# EAGLE schematic l5 (EAGLE 5.10)
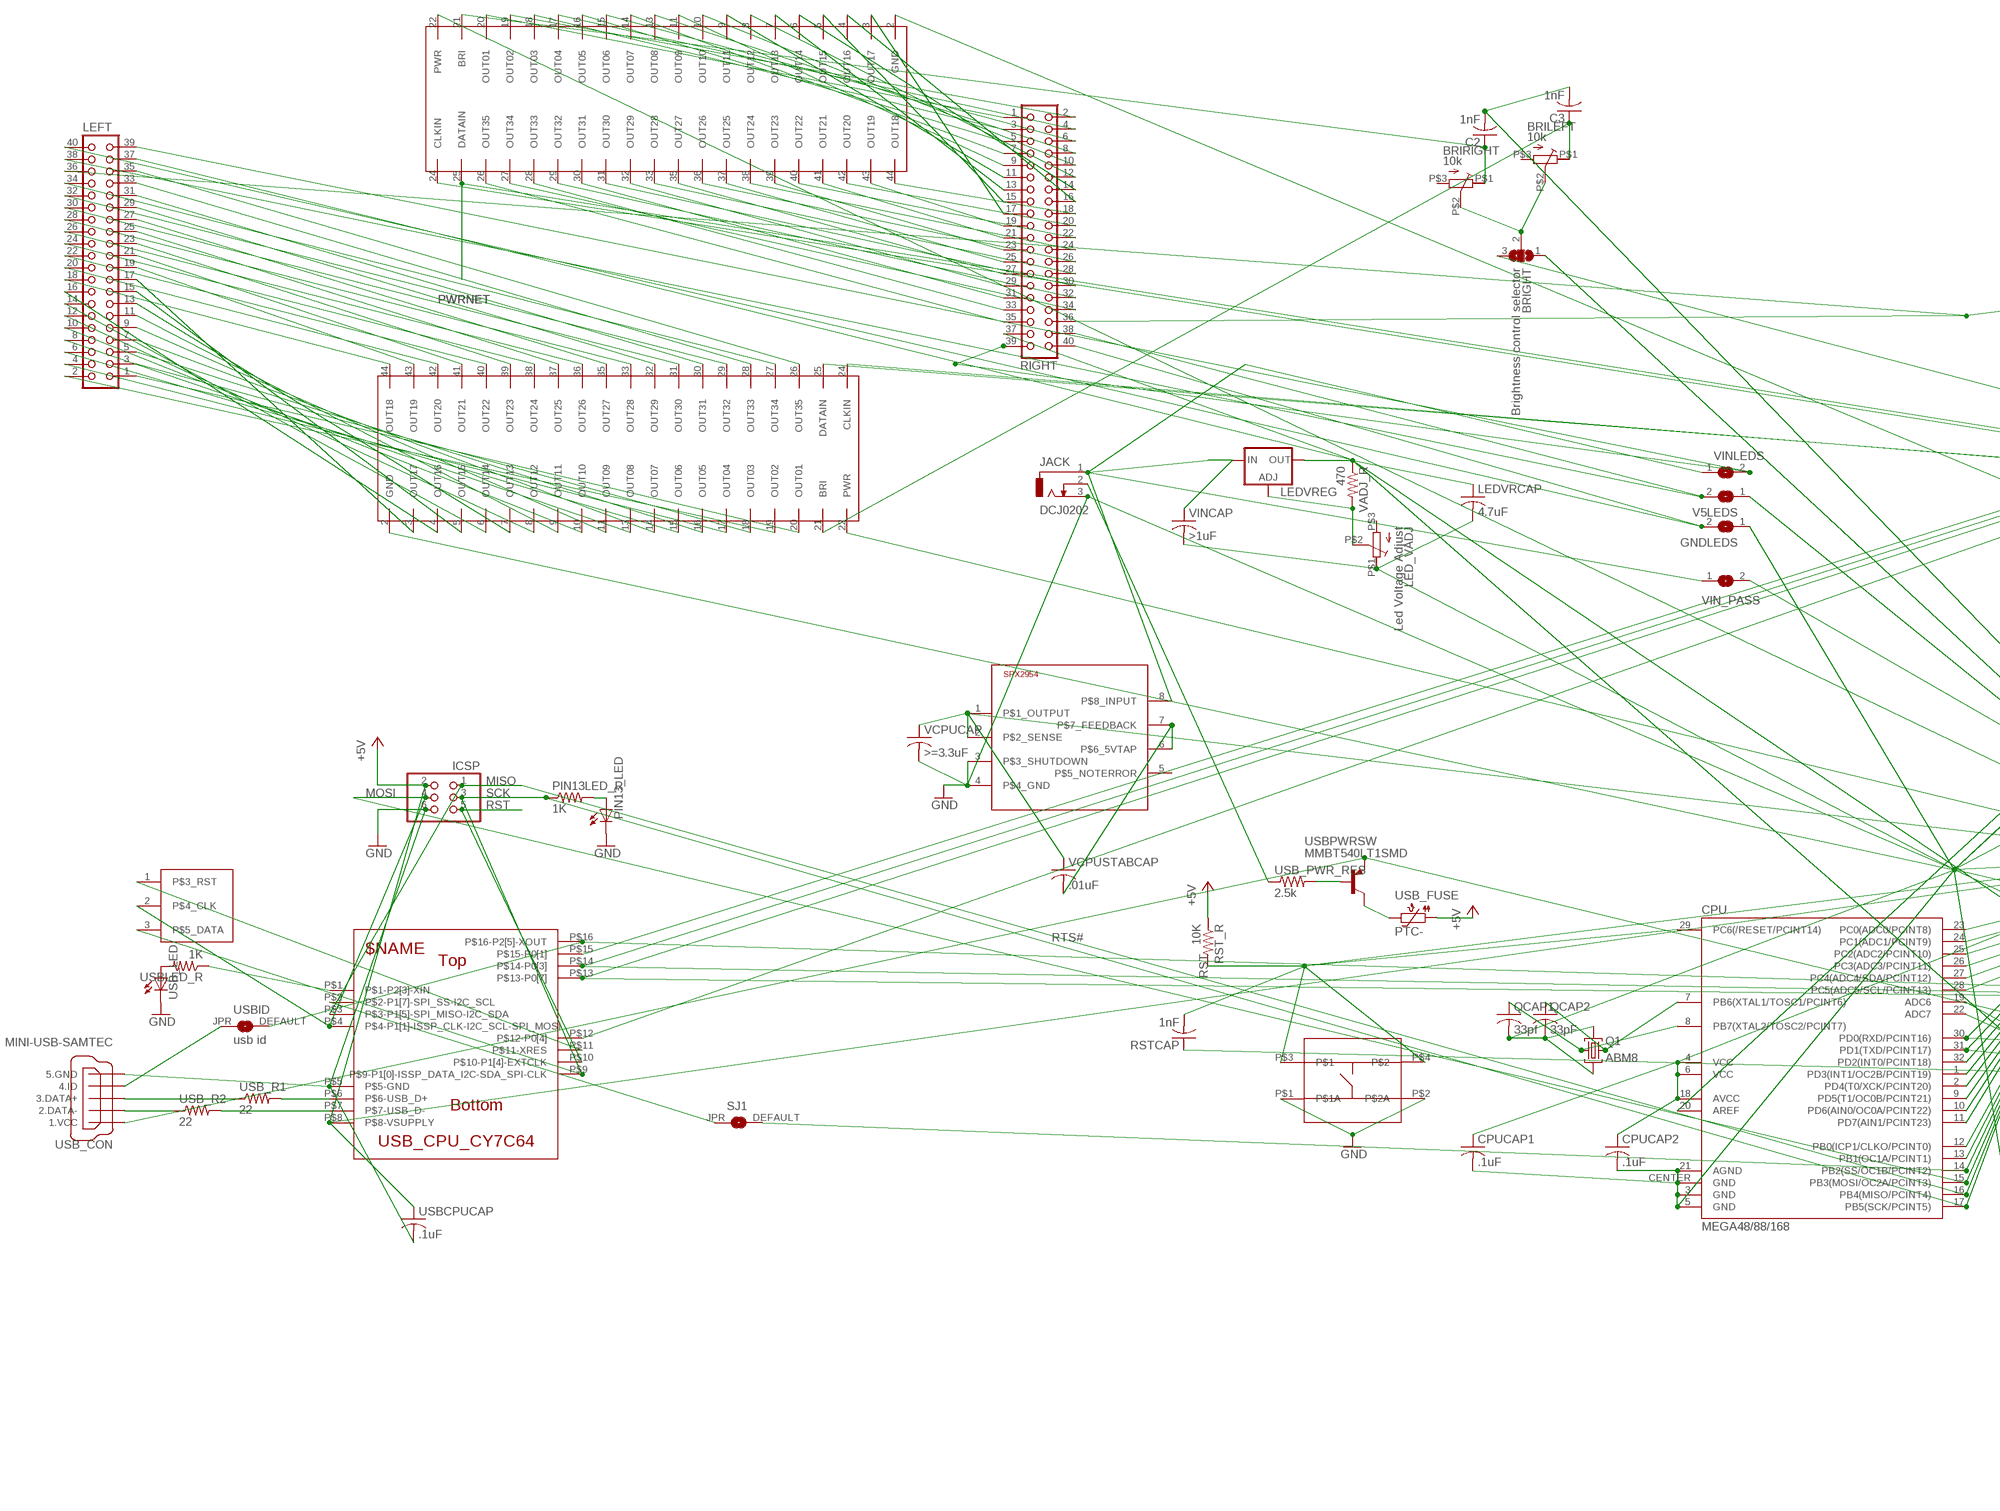
[diagram p0: schematic, sheet 1, part 1 of 2]
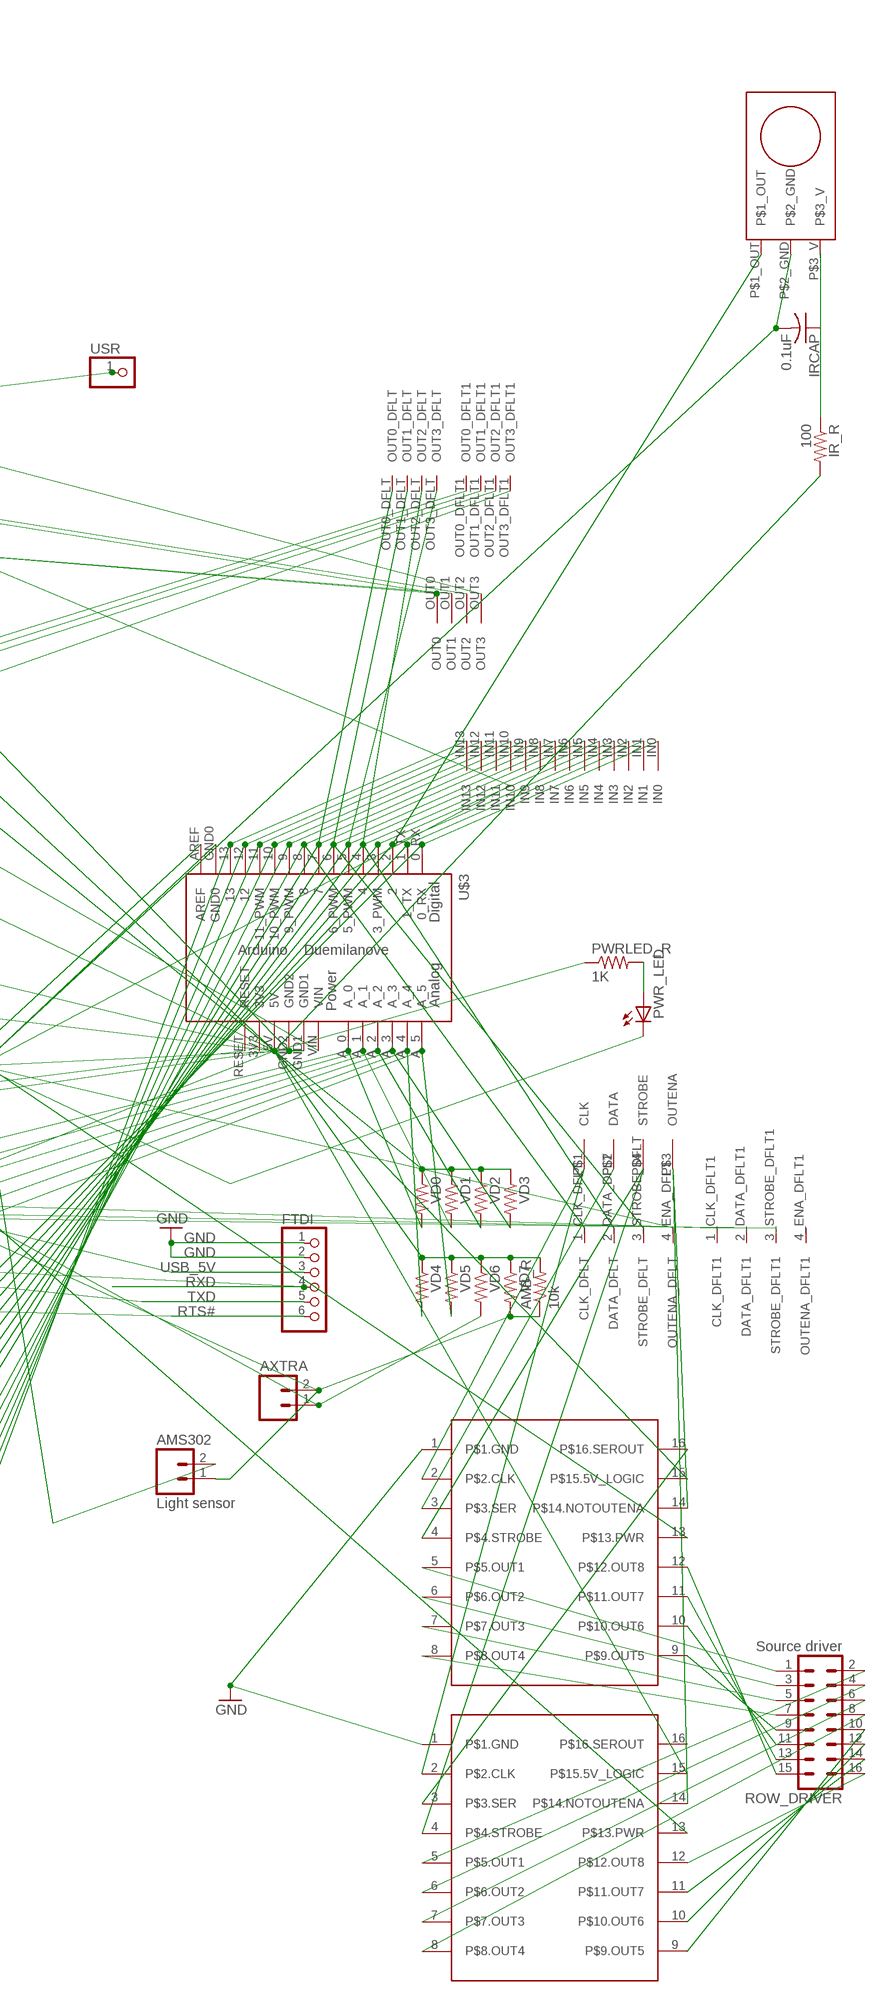
[diagram p1: schematic, sheet 1, part 2 of 2]

## Parts
5VREG  SPX2954  [SO08]
AMB_R  10k  R-US_R0603  [R0603]
AMS302  Light sensor  M02PTH  [1X02]
AXTRA  M02PTH  [1X02]
BRIGHT  Brightness control selector  SJ2W  [SJ_2]
BRILEFT  10k  PVZ2_TRIM_POT  [PVZ2A_TRIM_POT]
BRIRIGHT  10k  PVZ2_TRIM_POT  [PVZ2A_TRIM_POT]
C2  1nF  RCL_C-USC0603  [RCL_C0603]
C3  1nF  RCL_C-USC0603  [RCL_C0603]
CPU  MEGA48/88/168  [MLF32]
CPUCAP1  .1uF  C-USC0603  [C0603]
CPUCAP2  .1uF  C-USC0603  [C0603]
CY7C64316  USB_CPU_CY7C64315  [QFN16-3X3]
CY_PRG_MINI  CY_PRG_MIN  [HEADER_3X1]
DRVR_BOT  MIC5891  [SO16W]
DRVR_TOP  MIC5891  [SO16W]
FTDI  PINHD-1X6CLEAN  [1X06-CLEAN]
GNDLEDS  SJ  [SJ]
ICSP  PINHD-2X3  [2X03]
IR_R  100  R-US_R0603  [R0603]
IR_RECV  TSOP34138_IR_RECIEVER  [TSOP34138]
IRCAP  0.1uF  RCL_C-USC0603  [RCL_C0603]
JACK  DCJ0202  [DCJ0202]
LED_VADJ  Led Voltage Adjust  PVZ2_TRIM_POT  [PVZ2A_TRIM_POT]
LEDVRCAP  4.7uF  RCL_C-USC0805  [RCL_C0805]
LEDVREG  LM317BD2T  [D2PACK]
LEFT  CON-HARTING_CON40L  [CON-HARTING_CON40L]
M5451_LEFT  STONE_ST-M5451  [PLCC44]
M5451_RIGHT  STONE_ST-M5451  [PLCC44]
PIN13_LED  LEDCHIPLED_1206  [CHIPLED_1206]
PIN13LED_R  1K  R-US_R0603  [R0603]
PWR_LED  LEDCHIPLED_1206  [CHIPLED_1206]
PWRLED_R  1K  R-US_R0603  [R0603]
Q1  ABM8  [CRYSTAL_ABM8]
QCAP1  33pf  C-USC0603  [C0603]
QCAP2  33pF  C-USC0603  [C0603]
RESET_SWITCH  RA_SWITCH  [RA_SWITCH]
RIGHT  CON-HARTING_CON40L  [CON-HARTING_CON40L]
ROW_DRIVER  Source driver  MA08-2  [MA08-2]
RST_R  10K  R-US_R0603  [R0603]
RSTCAP  1nF  RCL_C-USC0603  [RCL_C0603]
SJ1  SJWIRE_HOLE_WITH_DEFAULT  [JUMPER_HOLE_WITH_SMT_DEFAULT_PAD]
U$3  ARDUINO-USBOCTAGONAL_PADS  [SHIELD-OCTAGONALPAD]
U$5  LEDSRCSEL  [LEDSRCSEL]
U$6  DUINO_DIGITAL_SOLDER_PTS  [DUINO_DIGITAL_SOLDER_PTS]
U$7  QUAD_SOLDER_PTS_WITH_2_DEFAULTS  [QUAD_SOLDER_PTS_WITH_2_DEFAULTS]
USB_CON  MINI-USB-SAMTEC  [SAMTEC_MUSB_05]
USB_FUSE  PTC-  [RCL_C0603]
USB_LED  LEDCHIPLED_1206  [CHIPLED_1206]
USB_PWR_RES  2.5k  R-US_R0603  [R0603]
USB_R1  22  R-US_R0603  [R0603]
USB_R2  22  R-US_R0603  [R0603]
USBCPUCAP  .1uF  C-USC0603  [C0603]
USBID  usb id  SJWIRE_HOLE_WITH_DEFAULT  [JUMPER_HOLE_WITH_SMT_DEFAULT_PAD]
USBLED_R  1K  R-US_R0603  [R0603]
USBPWRSW  MMBT540LT1SMD  [SOT23-BEC]
USR  PINHD-1X1  [1X01]
V5LEDS  SJ  [SJ]
VADJ_R  470  RCL_R-US_R0603  [RCL_R0603]
VCPUCAP  >=3.3uF  RCL_C-USC0603  [RCL_C0603]
VCPUSTABCAP  .01uF  C-USC0603  [C0603]
VD0  R-US_0204/5  [0204/5]
VD1  R-US_0204/5  [0204/5]
VD2  R-US_0204/5  [0204/5]
VD3  R-US_0204/5  [0204/5]
VD4  R-US_0204/5  [0204/5]
VD5  R-US_0204/5  [0204/5]
VD6  R-US_0204/5  [0204/5]
VD7  R-US_0204/5  [0204/5]
VIN_PASS  SJ  [SJ]
VINCAP  >1uF  C-USC0603  [C0603]
VINLEDS  SJ  [SJ]

## Nets
+5V [PWR]: 5VREG.1(P$1_OUTPUT) 5VREG.2(P$2_SENSE) AMB_R.2 BRIGHT.1 CPU.4(VCC) CPU.6(VCC) CPU.18(AVCC) CPUCAP1.1 CPUCAP2.1 CY7C64316.P$8(P$8-VSUPPLY) DRVR_BOT.15(P$15.5V_LOGIC) DRVR_TOP.15(P$15.5V_LOGIC) ICSP.2 IR_R.2 M5451_LEFT.22(PWR) M5451_RIGHT.22(PWR) PWRLED_R.1 RST_R.1 U$3.5V USB_FUSE.1 USBCPUCAP.1 V5LEDS.1 VCPUCAP.1 VCPUSTABCAP.1 VD0.1 VD1.1 VD2.1 VD3.1 VD4.1 VD5.1 VD6.1 VD7.1
BRIGHT_NET: BRIGHT.3 U$7.OUT3
BRISEL0 [CHIPCOM]: BRIRIGHT.P$1(A) C2.1 M5451_RIGHT.21(BRI)
BRISEL1 [CHIPCOM]: BRILEFT.P$1(A) C3.1 M5451_LEFT.21(BRI)
CLK [CHIPCOM]: M5451_LEFT.24(CLKIN) M5451_RIGHT.24(CLKIN) U$7.OUT0
CLK1: CPU.7(PB6(XTAL1/TOSC1/PCINT6)) Q1.P$3 QCAP2.1
CLK2: CPU.8(PB7(XTAL2/TOSC2/PCINT7)) Q1.P$1 QCAP1.1
CPUVOLTAGESEL2IDE [PWR]: LEFT.38 RIGHT.38 V5LEDS.2
DATA0 [CHIPCOM]: CPU.11(PD7(AIN1/PCINT23)) U$3.7 U$6.IN7 U$7.OUT0_DFLT
DATA1 [CHIPCOM]: CPU.9(PD5(T1/OC0B/PCINT21)) U$3.5(5_PWM) U$6.IN5 U$7.OUT3_DFLT
GND [GND]: 5VREG.3(P$3_SHUTDOWN) 5VREG.4(P$4_GND) AMS302.2 C2.2 C3.2 CPU.3(GND) CPU.5(GND) CPU.21(AGND) CPU.CENTER(GND) CPUCAP1.2 CPUCAP2.2 CY7C64316.P$5(P$5-GND) DRVR_BOT.1(P$1.GND) DRVR_TOP.1(P$1.GND) FTDI.1 FTDI.2 GNDLEDS.1 ICSP.6 IR_RECV.P$2_GND IRCAP.2 JACK.3 LED_VADJ.P$1(A) LEDVRCAP.2 M5451_LEFT.2(GND) M5451_RIGHT.2(GND) PIN13_LED.C PWR_LED.C Q1.P$GND1(GND1) Q1.P$GND2(GND2) QCAP1.2 QCAP2.2 RESET_SWITCH.P$1(P$1A) RESET_SWITCH.P$2(P$2A) U$3.GND0 U$3.GND1 U$3.GND2 U$5.4_ENA_DFLT(OUTENA_DFLT) USB_CON.5(5.GND) USB_LED.C USBCPUCAP.2 VCPUCAP.2 VINCAP.2
GND3 [GND]: GNDLEDS.2 LEFT.40 RIGHT.40
LEDPWR [LEDPWR]: DRVR_BOT.13(P$13.PWR) DRVR_TOP.13(P$13.PWR) LEDVRCAP.1 LEDVREG.2(OUT) LEFT.37 RIGHT.37 VADJ_R.1
LEFTDATA [CHIPCOM]: M5451_LEFT.25(DATAIN) U$7.OUT1
MISO: CPU.16(PB4(MISO/PCINT4)) CY7C64316.P$3(P$3-P1[5]-SPI_MISO-I2C_SDA) ICSP.1 U$3.12 U$6.IN12
MOSI [CHIPCOM]: CPU.15(PB3(MOSI/OC2A/PCINT3)) CY7C64316.P$4(P$4-P1[1]-ISSP_CLK-I2C_SCL-SPI_MOSI) CY_PRG_MINI.2(P$4_CLK) ICSP.4 U$3.11(11_PWM) U$6.IN11
N$1: PIN13_LED.A PIN13LED_R.2
N$2: BRIGHT.2 BRILEFT.P$2(S) BRIRIGHT.P$2(S)
N$3: AXTRA.1 CPU.19(ADC6) VD6.2
N$4 [PWR]: U$3.VIN VIN_PASS.2
N$5: AMB_R.1 AMS302.1 AXTRA.2 CPU.22(ADC7) VD7.2
N$6: M5451_RIGHT.20(OUT01) RIGHT.1
N$7: M5451_RIGHT.19(OUT02) RIGHT.2
N$8: M5451_RIGHT.18(OUT03) RIGHT.3
N$9: M5451_RIGHT.17(OUT04) RIGHT.4
N$10: M5451_RIGHT.16(OUT05) RIGHT.5
N$11: M5451_RIGHT.15(OUT06) RIGHT.6
N$12: M5451_RIGHT.14(OUT07) RIGHT.7
N$13: M5451_RIGHT.13(OUT08) RIGHT.8
N$14: M5451_RIGHT.11(OUT09) RIGHT.9
N$15: M5451_RIGHT.10(OUT10) RIGHT.10
N$16 [LEDROW]: DRVR_BOT.5(P$5.OUT1) ROW_DRIVER.1
N$17: M5451_RIGHT.9(OUT11) RIGHT.11
N$18: M5451_RIGHT.8(OUT12) RIGHT.12
N$19: M5451_RIGHT.7(OUT13) RIGHT.13
N$20: M5451_RIGHT.6(OUT14) RIGHT.14
N$21: M5451_RIGHT.5(OUT15) RIGHT.15
N$22: M5451_RIGHT.4(OUT16) RIGHT.16
N$23: M5451_RIGHT.3(OUT17) RIGHT.17
N$24: M5451_RIGHT.44(OUT18) RIGHT.18
N$25: M5451_RIGHT.43(OUT19) RIGHT.19
N$26: M5451_RIGHT.42(OUT20) RIGHT.20
N$27: M5451_RIGHT.41(OUT21) RIGHT.21
N$28: M5451_RIGHT.40(OUT22) RIGHT.22
N$29: M5451_RIGHT.39(OUT23) RIGHT.23
N$30: M5451_RIGHT.38(OUT24) RIGHT.24
N$31: M5451_RIGHT.37(OUT25) RIGHT.25
N$32: M5451_RIGHT.36(OUT26) RIGHT.26
N$33: M5451_RIGHT.35(OUT27) RIGHT.27
N$34: M5451_RIGHT.33(OUT28) RIGHT.28
N$35: M5451_RIGHT.32(OUT29) RIGHT.29
N$36: M5451_RIGHT.31(OUT30) RIGHT.30
N$37: M5451_RIGHT.30(OUT31) RIGHT.31
N$38: M5451_RIGHT.29(OUT32) RIGHT.32
N$39: M5451_RIGHT.28(OUT33) RIGHT.33
N$40: M5451_RIGHT.27(OUT34) RIGHT.34
N$41: M5451_RIGHT.26(OUT35) RIGHT.35
N$42 [LEDROW]: DRVR_BOT.6(P$6.OUT2) ROW_DRIVER.3
N$43: CPU.32(PD2(INT0/PCINT18)) IR_RECV.P$1_OUT U$3.2 U$6.IN2
N$44 [LEDROW]: DRVR_BOT.7(P$7.OUT3) ROW_DRIVER.5
N$45: LEFT.1 M5451_LEFT.20(OUT01)
N$46: LEFT.2 M5451_LEFT.19(OUT02)
N$47: LEFT.3 M5451_LEFT.18(OUT03)
N$48: LEFT.4 M5451_LEFT.17(OUT04)
N$49: CPU.1(PD3(INT1/OC2B/PCINT19)) U$3.3(3_PWM) U$6.IN3
N$50: LEFT.5 M5451_LEFT.16(OUT05)
N$51: LEFT.6 M5451_LEFT.15(OUT06)
N$52: LEFT.7 M5451_LEFT.14(OUT07)
N$53: LEFT.8 M5451_LEFT.13(OUT08)
N$54: LEFT.9 M5451_LEFT.11(OUT09)
N$55: LEFT.10 M5451_LEFT.10(OUT10)
N$56: LEFT.11 M5451_LEFT.9(OUT11)
N$57: LEFT.12 M5451_LEFT.8(OUT12)
N$58: LEFT.13 M5451_LEFT.7(OUT13)
N$59: LEFT.14 M5451_LEFT.6(OUT14)
N$60: LEFT.15 M5451_LEFT.5(OUT15)
N$61: LEFT.16 M5451_LEFT.4(OUT16)
N$62: LEFT.17 M5451_LEFT.3(OUT17)
N$63: LEFT.18 M5451_LEFT.44(OUT18)
N$64: LEFT.19 M5451_LEFT.43(OUT19)
N$65: LEFT.20 M5451_LEFT.42(OUT20)
N$66: LEFT.21 M5451_LEFT.41(OUT21)
N$67: LEFT.22 M5451_LEFT.40(OUT22)
N$68: LEFT.23 M5451_LEFT.39(OUT23)
N$69: LEFT.24 M5451_LEFT.38(OUT24)
N$70: LEFT.25 M5451_LEFT.37(OUT25)
N$71: LEFT.26 M5451_LEFT.36(OUT26)
N$72: LEFT.27 M5451_LEFT.35(OUT27)
N$73: LEFT.28 M5451_LEFT.33(OUT28)
N$74: LEFT.29 M5451_LEFT.32(OUT29)
N$75: LEFT.30 M5451_LEFT.31(OUT30)
N$76: LEFT.31 M5451_LEFT.30(OUT31)
N$77: LEFT.32 M5451_LEFT.29(OUT32)
N$78: LEFT.33 M5451_LEFT.28(OUT33)
N$79: LEFT.34 M5451_LEFT.27(OUT34)
N$80: CPU.2(PD4(T0/XCK/PCINT20)) U$3.4 U$5.2_DATA_DFLT(DATA_DFLT) U$6.IN4 U$7.OUT2_DFLT
N$81 [CHIPCOM]: CPU.10(PD6(AIN0/OC0A/PCINT22)) U$3.6(6_PWM) U$5.3_STROBE_DFLT(STROBE_DFLT) U$6.IN6 U$7.OUT1_DFLT
N$82: CY7C64316.P$1(P$1-P2[3]-XIN) USBLED_R.1
N$83: USB_CON.4(4.ID) USBID.JPR
N$84 [CHIPCOM]: CPU.12(PB0(ICP1/CLKO/PCINT0)) U$3.8 U$5.1_CLK_DFLT(CLK_DFLT) U$6.IN8
N$85 [CHIPCOM]: CPU.13(PB1(OC1A/PCINT1)) U$3.9(9_PWM) U$6.IN9
N$86 [CHIPCOM]: CPU.14(PB2(SS/OC1B/PCINT2)) SJ1.DEFAULT U$3.10(10_PWM) U$6.IN10
N$87 [LEDROW]: DRVR_BOT.8(P$8.OUT4) ROW_DRIVER.7
N$88 [LEDROW]: DRVR_BOT.9(P$9.OUT5) ROW_DRIVER.9
N$89 [LEDROW]: DRVR_BOT.10(P$10.OUT6) ROW_DRIVER.11
N$90: CY7C64316.P$15(P$15-P0[1]) U$7.OUT0_DFLT1
N$91: PWR_LED.A PWRLED_R.2
N$92: LED_VADJ.P$2(S) LEDVREG.1(ADJ) VADJ_R.2
N$93: LEFT.35 M5451_LEFT.26(OUT35)
N$94: CY7C64316.P$14(P$14-P0[3]) U$5.2_DATA_DFLT1(DATA_DFLT1) U$7.OUT1_DFLT1
N$95: CY7C64316.P$11(P$11-XRES) CY_PRG_MINI.1(P$3_RST)
N$96 [LEDROW]: DRVR_BOT.11(P$11.OUT7) ROW_DRIVER.13
N$97: CPU.23(PC0(ADC0/PCINT8)) U$3.A_0 VD0.2
N$98: CPU.24(PC1(ADC1/PCINT9)) U$3.A_1 VD1.2
N$99: CPU.25(PC2(ADC2/PCINT10)) U$3.A_2 VD2.2
N$100: CPU.26(PC3(ADC3/PCINT11)) U$3.A_3 VD3.2
N$101: CPU.27(PC4(ADC4/SDA/PCINT12)) U$3.A_4 VD4.2
N$102: CPU.28(PC5(ADC5/SCL/PCINT13)) U$3.A_5 VD5.2
N$103 [LEDROW]: DRVR_BOT.12(P$12.OUT8) ROW_DRIVER.15
N$104 [LEDROW]: DRVR_TOP.5(P$5.OUT1) ROW_DRIVER.2
N$105: CPU.20(AREF) U$3.AREF
N$106 [LEDROW]: DRVR_TOP.6(P$6.OUT2) ROW_DRIVER.4
N$107 [LEDROW]: DRVR_TOP.7(P$7.OUT3) ROW_DRIVER.6
N$108 [LEDROW]: DRVR_TOP.8(P$8.OUT4) ROW_DRIVER.8
N$109 [LEDROW]: DRVR_TOP.9(P$9.OUT5) ROW_DRIVER.10
N$110 [LEDROW]: DRVR_TOP.10(P$10.OUT6) ROW_DRIVER.12
N$111 [LEDROW]: DRVR_TOP.11(P$11.OUT7) ROW_DRIVER.14
N$112 [LEDROW]: DRVR_TOP.12(P$12.OUT8) ROW_DRIVER.16
N$113 [CHIPCOM]: DRVR_BOT.2(P$2.CLK) DRVR_TOP.2(P$2.CLK) U$5.P$1(CLK)
N$114 [LEDROW]: DRVR_BOT.16(P$16.SEROUT) DRVR_TOP.3(P$3.SER)
N$115 [CHIPCOM]: DRVR_BOT.3(P$3.SER) U$5.P$2(DATA)
N$116 [CHIPCOM]: DRVR_BOT.14(P$14.NOTOUTENA) DRVR_TOP.14(P$14.NOTOUTENA) U$5.P$3(OUTENA)
N$117 [CHIPCOM]: DRVR_BOT.4(P$4.STROBE) DRVR_TOP.4(P$4.STROBE) U$5.P$4(STROBE)
N$118: IR_R.1 IR_RECV.P$3_V IRCAP.1
N$119: CY7C64316.P$13(P$13-P0[7]) U$5.3_STROBE_DFLT1(STROBE_DFLT1) U$7.OUT2_DFLT1
N$120: 5VREG.6(P$6_5VTAP) 5VREG.7(P$7_FEEDBACK) VCPUSTABCAP.2
N$121: CY7C64316.P$12(P$12-P0[4]) U$7.OUT3_DFLT1
N$122: USB_PWR_RES.2 USBPWRSW.B
N$123: JACK.2 USB_PWR_RES.1
N$125: CY7C64316.P$2(P$2-P1[7]-SPI_SS-I2C_SCL) SJ1.JPR
N$126 [PWR]: USB_FUSE.2 USBPWRSW.C
N$128: CY7C64316.P$16(P$16-P2[5]-XOUT) U$5.1_CLK_DFLT1(CLK_DFLT1) USBID.DEFAULT
N$129: USB_LED.A USBLED_R.2
N$131: USB_CON.3(3.DATA+) USB_R1.1
N$132: CY7C64316.P$7(P$7-USB_D-) USB_R2.2
N$133: CY7C64316.P$6(P$6-USB_D+) USB_R1.2
PWR2IDE [PWR]: LEFT.39 RIGHT.39 VINLEDS.2
PWRNET [GND]: 5VREG.8(P$8_INPUT) JACK.1 LEDVREG.3(IN) VIN_PASS.1 VINCAP.1 VINLEDS.1
RIGHTDATA [CHIPCOM]: M5451_RIGHT.25(DATAIN) U$7.OUT2
RST: CPU.29(PC6(/RESET/PCINT14)) CY7C64316.P$10(P$10-P1[4]-EXTCLK) ICSP.5 RESET_SWITCH.P$3 RESET_SWITCH.P$4 RST_R.2 RSTCAP.2 U$3.RESET
RTS#: FTDI.6 RSTCAP.1
RXD: CPU.30(PD0(RXD/PCINT16)) FTDI.4 U$3.0_RX U$6.IN0
SCK: CPU.17(PB5(SCK/PCINT5)) CY7C64316.P$9(P$9-P1[0]-ISSP_DATA_I2C-SDA_SPI-CLK) CY_PRG_MINI.3(P$5_DATA) ICSP.3 PIN13LED_R.1 U$3.13 U$6.IN13
TXD: CPU.31(PD1(TXD/PCINT17)) FTDI.5 U$3.1_TX U$6.IN1
USB_5V [PWR]: FTDI.3 USB_CON.1(1.VCC) USBPWRSW.E
USB_DM: USB_CON.2(2.DATA-) USB_R2.1
USRPWR [PWR]: LEFT.36 RIGHT.36 USR.1
Unconnected: 5VREG.5(P$5_NOTERROR) BRILEFT.P$3(E) BRIRIGHT.P$3(E) DRVR_TOP.16(P$16.SEROUT) LED_VADJ.P$3(E) U$5.4_ENA_DFLT1(OUTENA_DFLT1)

## Power pins joined to a net without a drawn wire
3V3: U$3.3V3

## Library data of the parts
5VREG = lightuino3.lbrlightuino3.1:SPX2954
AMB_R IR_R PIN13LED_R PWRLED_R RST_R USB_PWR_RES USB_R1 USB_R2 USBLED_R VD0 VD1-VD7 = resistor:R-US_: RESISTOR, American symbol
AMS302 AXTRA = SparkFun:M02: Header 2 Standard 2-pin 0.1" header. Use with straight break away headers (SKU : PRT-00116), right angle break away headers (PRT-00553), swiss pins (PRT-00743), machine pins (PRT-00117), and female headers (PRT-00115). Molex polarized connector foot print use with SKU : PRT-08233 with associated crimp pins and housings.
BRIGHT = jumper:SJ2W: SMD solder JUMPER
BRILEFT BRIRIGHT LED_VADJ = lightuino3.lbrlightuino3.1:PVZ2_TRIM_POT
C2 C3 IRCAP LEDVRCAP RSTCAP VCPUCAP = lightuino3.lbrlightuino3.1:RCL_C-US: CAPACITOR, American symbol
CPU = ledshield2:MEGA48/88/168
CPUCAP1 CPUCAP2 QCAP1 QCAP2 USBCPUCAP VCPUSTABCAP VINCAP = rcl:C-US: CAPACITOR, American symbol
CY7C64316 = duinochip:USB_CPU_CY7C64315
CY_PRG_MINI = lightuino3.lbrlightuino3.1:CY_PRG_MIN
DRVR_BOT DRVR_TOP = lightuino3.lbrlightuino3.1:MIC5891
FTDI = carduino:PINHD-1X6: PIN HEADER
GNDLEDS V5LEDS VIN_PASS VINLEDS = jumper:SJ: SMD solder JUMPER
ICSP = pinhead-ez:PINHD-2X3: PIN HEADER
IR_RECV = lightuino3.lbrlightuino3.1:TSOP34138_IR_RECIEVER
JACK = con-jack:DCJ0202: DC POWER JACK Source: DCJ0202.pdf
LEDVREG = v-reg:LM317?*: 500 mA Adjustable Output Positive Voltage Regulator Source: http://www.onsemi.co.jp .. LM317M-D.PDF
LEFT RIGHT = lightuino3.lbrlightuino3.1:CON-HARTING_CON40L: CONNECTOR
M5451_LEFT M5451_RIGHT = lightuino3.lbrlightuino3.1:STONE_ST-M5451
PIN13_LED PWR_LED USB_LED = led:LED: LED OSRAM: - CHIPLED LG R971, LG N971, LY N971, LG Q971, LY Q971, LO R971, LY R971 LH N974, LH R974 LS Q976, LO Q976, LY Q976 LO Q996 - Hyper CHIPLED LW Q18S LB Q993, LB Q99A, LB R99A - SideLED LS A670, LO A670, LY A670, LG A670, LP A670 LB A673, LV A673, LT A673, LW A673 LH A674 LY A675 LS A676, LA A676, LO A676, LY A676, LW A676 LS A679, LY A679, LG A679 - Hyper Micro SIDELED® LS Y876, LA Y876, LO Y876, LY Y876 LT Y87S - SmartLED LW L88C, LW L88S LB L89C, LB L89S, LG L890 LS L89K, LO L89K, LY L89K LS L896, LA L896, LO L896, LY L896 - TOPLED LS T670, LO T670, LY T670, LG T670, LP T670 LSG T670, LSP T670, LSY T670, LOP T670, LYG T670 LG T671, LOG T671, LSG T671 LB T673, LV T673, LT T673, LW T673 LH T674 LS T676, LA T676, LO T676, LY T676, LB T676, LH T676, LSB T676, LW T676 LB T67C, LV T67C, LT T67C, LS T67K, LO T67K, LY T67K, LW E67C LS E67B, LA E67B, LO E67B, LY E67B, LB E67C, LV E67C, LT E67C LW T67C LS T679, LY T679, LG T679 LS T770, LO T770, LY T770, LG T770, LP T770 LB T773, LV T773, LT T773, LW T773 LH T774 LS E675, LA E675, LY E675, LS T675 LS T776, LA T776, LO T776, LY T776, LB T776 LHGB T686 LT T68C, LB T68C - Hyper Mini TOPLED® LB M676 - Mini TOPLED Santana® LG M470 LS M47K, LO M47K, LY M47K Source: http://www.osram.convergy.de LUXEON: - LUMILED® LXK2-PW12-R00, LXK2-PW12-S00, LXK2-PW14-U00, LXK2-PW14-V00 LXK2-PM12-R00, LXK2-PM12-S00, LXK2-PM14-U00 LXK2-PE12-Q00, LXK2-PE12-R00, LXK2-PE12-S00, LXK2-PE14-T00, LXK2-PE14-U00 LXK2-PB12-K00, LXK2-PB12-L00, LXK2-PB12-M00, LXK2-PB14-N00, LXK2-PB14-P00, LXK2-PB14-Q00 LXK2-PR12-L00, LXK2-PR12-M00, LXK2-PR14-Q00, LXK2-PR14-R00 LXK2-PD12-Q00, LXK2-PD12-R00, LXK2-PD12-S00 LXK2-PH12-R00, LXK2-PH12-S00 LXK2-PL12-P00, LXK2-PL12-Q00, LXK2-PL12-R00 Source: www.luxeon.com KINGBRIGHT: KA-3528ASYC Source: www.kingbright.com
Q1 = lightuino3.lbrlightuino3.1:ABM8
RESET_SWITCH = lightuino3.lbrlightuino3.1:RA_SWITCH: TL1014AF180QG E-switch
ROW_DRIVER = con-lstb:MA08-2: PIN HEADER
SJ1 USBID = lightuino3.lbrlightuino3.1:SJ: SMD solder JUMPER
U$3 = Arduino-Various:ARDUINO-USB: The Ardiuno Duemilanove Pinouts layoutet as a Bare Shield. v0.5 Also for Arduino Diecimila. This is designed as a Part and has no Outline in the Dimension Layer. The Outline, when present, is drawed at the tPlace / bPlace Layer. Library by Stephanie Lange, http://www.k-ita.de/~sl/
U$5 = lightuino3.lbrlightuino3.1:LEDSRCSEL
U$6 = lightuino3.lbrlightuino3.1:DUINO_DIGITAL_SOLDER_PTS
U$7 = lightuino3.lbrlightuino3.1:QUAD_SOLDER_PTS_WITH_2_DEFAULTS
USB_CON = duinochip:MINI-USB-: MINI USB Connector Source: http://www.hirose.co.jp/cataloge_hp/e24000019.pdf
USB_FUSE = lightuino3.lbrlightuino3.1:PTC-: Positive Temperature Coefficient Resistor (PTC) termistor Philips KTY81-210 - KTY81-252 Source: 153627-da-01-en-Temperatur-Sensor_KTY10-6_Philips.pdf
USBPWRSW = lightuino3.lbrlightuino3.1:MMBT540*: PNP Transistror
USR = pinhead:PINHD-1X1: PIN HEADER
VADJ_R = lightuino3.lbrlightuino3.1:RCL_R-US_: RESISTOR, American symbol

## Net classes
1 PWR: width 0.305 mm, clearance 0.203 mm
2 GND: width 0.508 mm, clearance 0.203 mm
3 CHIPCOM: width 0.203 mm, clearance 0.152 mm
4 solder: clearance 1.524 mm
5 LEDROW: width 0.305 mm, clearance 0.203 mm
6 LEDPWR: width 0.381 mm, clearance 0.254 mm